# EasyEDA Pro project Jalousee PCB.eprj, board PCB2
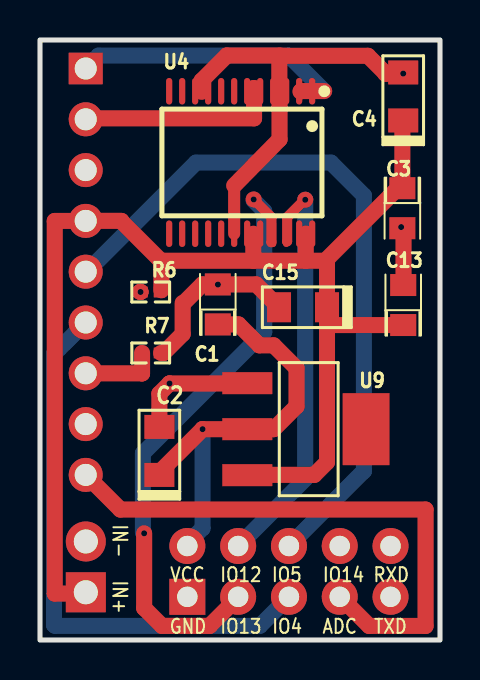
[diagram p9: board, top side]
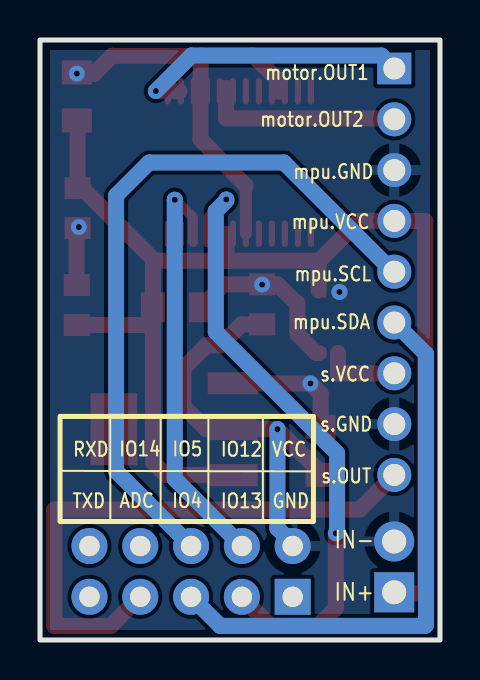
[diagram p10: board, bottom side, seen from below]

Outline 20 x 30 mm; copper layers: Top Layer, Bottom Layer. Coordinates in mm from the lower left corner of the outline.
Outline path: rectangle 0,30 20,0
Stack: Top Layer 0.035mm / Dielectric1 1.51mm FR4 er 4.5 / Bottom Layer 0.035mm

## Design rules (mm)
spacing safeClearance (default): track to track 0.152, other pairs 0.152 to 0.3
track width trackWidth (default): min 0.127, default 0.254, max 2.54
differential pair differentialPair (default): width min 0.127, default 0.254, max 2.54; gap min 0.152, default 0.152
via viaSize (default): diameter min 0.5, default 0.61, max 10; hole min 0.3, default 0.305, max 6

## Placement (name value [footprint] x y rotation side)
C1  10uF  [CAP-SMD_L2.0-W1.3-FD]  8.89 16.78 90 top
C2  100nF  [CAP-SMD_L3.2-W1.6-FD]  5.97 9.45 90 top
C3  10uF  [CAP-SMD_L2.0-W1.3-FD]  18.12 21.59 270 top
C4  100nF  [CAP-SMD_L3.2-W1.6-FD]  18.16 27.18 90 top
C13  10uF  [CAP-SMD_L2.0-W1.3-FD]  18.16 16.75 90 top
C15  100nF  [CAP-SMD_L3.2-W1.6-FD]  13.15 16.64 180 top
R6  1kΩ  [R0402]  5.54 17.4 0 top
R7  4.7kΩ  [R0402]  5.54 14.35 0 top
U1  -  [CONN-TH_10P-P2.54_DEALON_DW254R-22-10-85]  12.45 3.43 0 bottom
U4  -  [SSOP-24_L8.3-W5.6-P0.65-LS7.6-BL]  10.03 23.88 180 top
U5  -  [HDR-TH_9P-P2.54-V-F]  2.29 18.41 270 top
U8  -  [HDR-TH_2P-P2.54-V-F]  2.29 3.66 90 top
U9  -  [SOT-223-3_L6.5-W3.4-P2.30-LS7.0-BR]  13.34 10.54 180 top

## Footprints (pads in the part's own frame, mm; a bottom-side part is the same pattern mirrored in y, then rotated)
CAP-SMD_L2.0-W1.3-FD
  rect 1.1x1.3 smd: 1(-1,0) 2(1,0)
CAP-SMD_L3.2-W1.6-FD
  rect 1.2x1.5 smd: 1(-1.2,0) 2(1.2,0)
CONN-TH_10P-P2.54_DEALON_DW254R-22-10-85
  rect 1.8x1.8 hole 1.02: 1(-5.08,1.27)
  round 1.8 hole 1.02: 2(-5.08,-1.27) 3(-2.54,1.27) 4(-2.54,-1.27) 5(0,1.27) 6(0,-1.27) 7(2.54,1.27) 8(2.54,-1.27) 9(5.08,1.27) 10(5.08,-1.27)
HDR-TH_2P-P2.54-V-F
  rect 2x2 hole 1.2: 1(-1.27,0)
  round 2 hole 1.2: 2(1.27,0)
HDR-TH_9P-P2.54-V-F
  rect 1.575x1.7 hole 1.1: 1(-10.16,0)
  round 1.7 hole 1.1: 2(-7.62,0) 3(-5.08,0) 4(-2.54,0) 5(0,0) 6(2.54,0) 7(5.08,0) 8(7.62,0) 9(10.16,0)
R0402
  rect 0.566x0.54 smd: 1(-0.433,0) 2(0.433,0)
SOT-223-3_L6.5-W3.4-P2.30-LS7.0-BR
  rect 2.5x1.1 smd: 1(2.97,-2.3) 2(2.97,0) 3(2.97,2.3)
  rect 2.34x3.6 smd: 4(-2.97,0)
SSOP-24_L8.3-W5.6-P0.65-LS7.6-BL
  oval 0.308x1.324 smd: 1(-3.575,-3.562) 2(-2.925,-3.562) 3(-2.275,-3.562) 4(-1.625,-3.562) 5(-0.975,-3.562) 6(-0.325,-3.562) 7(0.325,-3.562) 8(0.975,-3.562) 9(1.625,-3.562) 10(2.275,-3.562) 11(2.925,-3.562) 12(3.575,-3.562) 13(3.575,3.562) 14(2.925,3.562) 15(2.275,3.562) 16(1.625,3.562) 17(0.975,3.562) 18(0.325,3.562) 19(-0.325,3.562) 20(-0.975,3.562) 21(-1.625,3.562) 22(-2.275,3.562) 23(-2.925,3.562) 24(-3.575,3.562)

## Nets
As in the schematic.

Pads without a net: U1 7 9 10; U4 7 8 11 12 13 14 15 16 17; U9 4

## Via types
v1: diameter 0.8, hole 0.305, Top Layer to Bottom Layer, 8 vias
v2: diameter 0.61, hole 0.305, Top Layer to Bottom Layer, 2 vias

## Routing (per net, layer and track width the routed paths; a pad name or vN(x,y) marks a point on that pad's centre or on a via; arc(x,y) is an arc through that point)
$1N39: length 65.8
  Top Layer w0.8: 13.29,20.32 13.29,20.28 ; 13.29,20.28 13.29,18.96 ; 13.29,20.28 13.28,20.27 ; 14.35,15.75 14.35,8.89 13.72,8.25 10.38,8.25 U9.3 ; 14.35,15.75 C13.1 ; 14.35,15.75 C15.1 14.35,18.96 14.27,18.96 ; 14.27,18.96 17.89,22.59 C3.1 18.12,25.94 C4.1 ; 14.27,18.96 13.29,18.96 ; 6.07,18.96 6.07,17.49 ; 6.07,18.96 6.04,18.96 ; 6.07,18.96 6.08,18.97 ; 6.07,18.96 10.67,18.96 ; 13.29,18.96 10.67,18.96 ; 6.04,18.96 6.01,18.96 ; 6.04,18.96 4.07,20.93 4.07,20.95 U5.4 2.28,20.95 0.74,20.95 0.74,2.32 2.26,2.32 2.29,2.35 ; 10.67,20.31 10.67,18.96
$1N40: length 31.3
  Top Layer w0.5: 11.56,19.89 11.57,19.89 11.57,21.14 v1(10.68,22.03)
  Top Layer w0.8: 9.91,2.13 8.48,0.71 6.1,0.71 5.21,1.6 v2(5.21,5.33)
  Bottom Layer w0.8: v2(5.21,5.33) 5.15,5.39 5.15,9.34 11.21,15.4 11.21,21.44 10.68,21.98
$1N41: length 21.2
  Top Layer w0.5: v1(13.26,22.01) 13.23,22.01 12.36,21.14 12.36,19.94 12.35,19.93
  Bottom Layer w0.8: 9.91,4.7 13.26,8.05 v1(13.26,22.01)
$1N43: length 14.1
  Top Layer w0.8: v2(14.21,27.45) 13.05,27.45 13.02,27.42
  Bottom Layer w0.8: v2(14.21,27.45) 12.43,29.22 2.93,29.22 U5.1
$1N44: length 10
  Top Layer w0.8: 10.69,27.6 10.7,27.59 10.7,26.08 2.33,26.08 U5.2
$1N47: length 28.2
  Bottom Layer w0.254: 2.31,15.89 2.32,15.89
  Bottom Layer w0.8: 12.45,2.16 10.99,0.71 0.75,0.71 0.7,0.76 0.7,14.3 2.28,15.88
$1N57: length 39.2
  Top Layer w0.6: 9.71,22.72 U4.18
  Top Layer w0.8: v1(18.16,28.32) 17.28,28.32 ; 17.28,28.32 16.4,29.21 12.03,29.21 12.01,29.23 ; 17.28,28.32 17.27,28.31 ; 11.97,29.18 11.97,27.46 11.98,27.45 11.98,25.03 9.71,22.72 ; 7.13,16.85 7.13,15.3 6.18,14.35 6.06,14.35 ; C15.2 10.81,17.78 C1.2 8.12,17.78 7.17,16.83 ; 5.01,17.41 5.02,17.41 v1(5.03,17.4) ; v1(18.06,20.65) 18.18,20.53 18.18,17.76 C13.2 ; U9.1 10.35,12.83 v1(6.48,12.83) 5.97,12.32 C2.2 ; 8.08,27.41 8.08,27.97 9.34,29.23 11.91,29.23
  vias: v1(8.9,17.77)
$1N58: length 3.8
  Top Layer w0.8: U5.7 5.1,13.33 5.1,13.33 R7.1
$1N59: length 28.4
  Top Layer w0.8: U5.9 4.02,6.52 19.28,6.52 19.28,0.7 16.46,0.7 15.01,2.15 14.98,2.15
$1N28414: length 21.3
  Top Layer w0.8: C1.1 9.93,15.78 10.97,14.73 11.68,14.73 12.83,13.59 12.83,11.68 11.68,10.54 U9.2 v1(8.13,10.54) 5.97,8.38 C2.1
  Bottom Layer w0.8: v1(8.13,10.54) 8.13,5.59 7.37,4.83 7.37,4.7
$1N29819: length 36
  Bottom Layer w0.8: 2.25,18.47 2.33,18.4 7.8,23.87 14.55,23.87 16.2,22.22 16.2,8.45 12.45,4.7

## Copper pours and planes (outline as drawn; the poured copper is in the pictures)
$1N57 on Bottom Layer: -0.13,30.17 20.24,30.17 20.24,-0.19 -0.13,-0.19

## Text on the board
Bottom Silkscreen Layer: s.OUT | s.VCC | s.GND | mpu.SCL | mpu.GND | mpu.SDA | mpu.VCC | GND | VCC | motor.OUT1 | motor.OUT2 | IO12 | IO13 | IO5 | IO4 | ADC | IO14 | RXD | TXD | IN- | IN+
Top Silkscreen Layer: GND | VCC | IO12 | IO13 | IO5 | IO4 | ADC | IO14 | RXD | TXD | IN- | IN+ | C2
